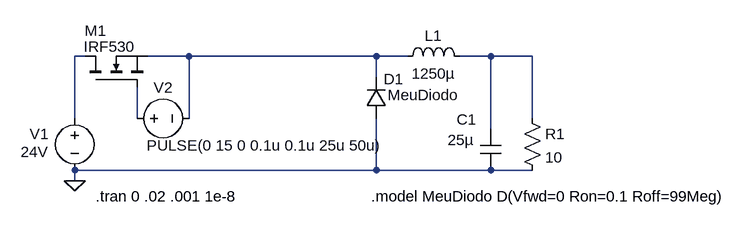
[diagram p0: schematic Tutorial_LTSpice_Ep6-Chaveados.asc]
Tutorial_LTSpice_Ep6-Chaveados.asc, the LTspice schematic file:
Version 4
SHEET 1 1152 680
WIRE 112 -64 96 -64
WIRE 272 -64 208 -64
WIRE 560 -64 272 -64
WIRE 608 -64 560 -64
WIRE 736 -64 688 -64
WIRE 800 -64 736 -64
WIRE 560 -32 560 -64
WIRE 96 32 96 -64
WIRE 192 32 192 -16
WIRE 272 32 272 -64
WIRE 800 32 800 -64
WIRE 736 48 736 -64
WIRE 560 112 560 32
WIRE 560 112 96 112
WIRE 736 112 560 112
WIRE 800 112 736 112
WIRE 96 128 96 112
FLAG 96 128 0
SYMBOL voltage 96 16 R0
WINDOW 3 -83 68 Left 2
WINDOW 0 -69 40 Left 2
SYMATTR Value 24V
SYMATTR InstName V1
SYMBOL voltage 176 32 R270
WINDOW 0 32 56 VTop 2
WINDOW 3 -26 213 VBottom 2
WINDOW 123 0 0 Left 2
WINDOW 39 0 0 Left 2
SYMATTR InstName V2
SYMATTR Value PULSE(0 15 0 0.1u 0.1u 25u 50u)
SYMBOL nmos 112 -16 R270
WINDOW 0 87 -1 VRight 2
WINDOW 3 63 -2 VRight 2
SYMATTR InstName M1
SYMATTR Value IRF530
SYMBOL ind 592 -48 R270
WINDOW 0 32 56 VTop 2
WINDOW 3 5 56 VBottom 2
SYMATTR InstName L1
SYMATTR Value 1250µ
SYMBOL cap 720 48 R0
WINDOW 0 -36 -14 Left 2
WINDOW 3 -50 17 Left 2
SYMATTR InstName C1
SYMATTR Value 25µ
SYMBOL res 784 16 R0
SYMATTR InstName R1
SYMATTR Value 10
SYMBOL diode 576 32 R180
WINDOW 0 -26 61 Left 2
WINDOW 3 -112 36 Left 2
SYMATTR InstName D1
SYMATTR Value MeuDiodo
TEXT 128 152 Left 2 !.tran 0 .02 .001 1e-8
TEXT 552 152 Left 2 !.model MeuDiodo D(Vfwd=0 Ron=0.1 Roff=99Meg)

The netlist it stands for:
* Tutorial_LTSpice_Ep6-Chaveados.asc
V1 N001 0 24V
V2 N004 N002 PULSE(0 15 0 0.1u 0.1u 25u 50u)
M1 N001 N004 N002 N002 IRF530
L1 N002 N003 1250µ
C1 N003 0 25µ
R1 N003 0 10
D1 0 N002 MeuDiodo
.model D D
.lib standard.dio
.model NMOS NMOS
.model PMOS PMOS
.lib standard.mos
.tran 0 .02 .001 1e-8
.model MeuDiodo D(Vfwd=0 Ron=0.1 Roff=99Meg)
.backanno
.end